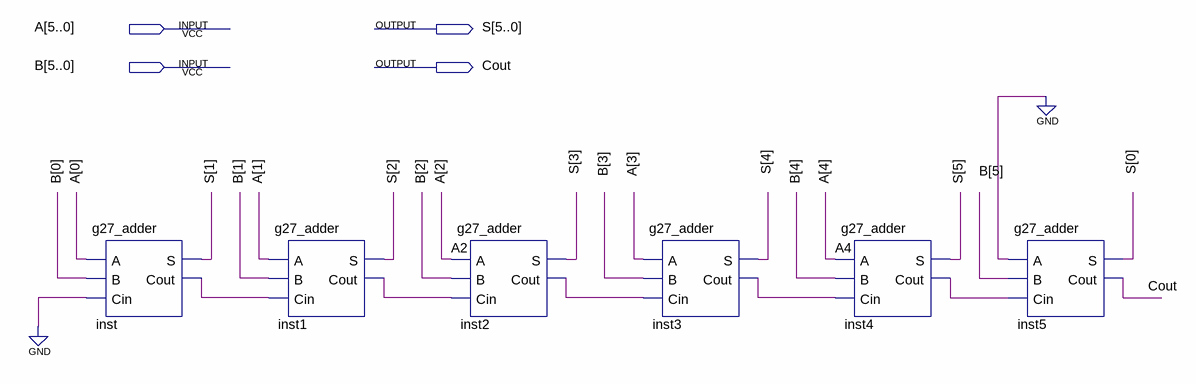
[diagram p0: schematic sheet]
// Quartus schematic g27_6bit_shift_left.bdf as structural Verilog: 6 symbols, 4 pins
module g27_6bit_shift_left (
  input  [5:0] A,
  input  [5:0] B,
  output [5:0] S,
  output Cout
);

  wire inst1_cout, inst2_cout, inst3_cout, inst4_cout, inst_cout;

  g27_adder inst (.A(A[0]), .B(B[0]), .Cin(1'b0), .S(S[1]), .Cout(inst_cout));
  g27_adder inst1 (.A(A[1]), .B(B[1]), .Cin(inst_cout), .S(S[2]), .Cout(inst1_cout));
  g27_adder inst2 (.A(A[2]), .B(B[2]), .Cin(inst1_cout), .S(S[3]), .Cout(inst2_cout));
  g27_adder inst3 (.A(A[3]), .B(B[3]), .Cin(inst2_cout), .S(S[4]), .Cout(inst3_cout));
  g27_adder inst4 (.A(A[4]), .B(B[4]), .Cin(inst3_cout), .S(S[5]), .Cout(inst4_cout));
  g27_adder inst5 (.A(1'b0), .B(B[5]), .Cin(inst4_cout), .S(S[0]), .Cout(Cout));
endmodule
